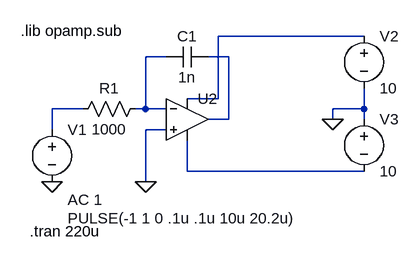
[diagram p0: schematic idealintegrator.asc]
idealintegrator.asc, the LTspice schematic file:
Version 4
SHEET 1 880 680
WIRE 576 32 352 32
WIRE 272 64 240 64
WIRE 368 64 336 64
WIRE 352 128 352 32
WIRE 352 128 304 128
WIRE 144 144 96 144
WIRE 240 144 240 64
WIRE 240 144 224 144
WIRE 272 144 240 144
WIRE 576 144 576 112
WIRE 576 144 528 144
WIRE 368 160 368 64
WIRE 368 160 336 160
WIRE 528 160 528 144
WIRE 576 160 576 144
WIRE 96 176 96 144
WIRE 272 176 240 176
WIRE 304 240 304 192
WIRE 576 240 304 240
WIRE 240 256 240 176
FLAG 240 256 0
FLAG 96 256 0
FLAG 528 160 0
SYMBOL res 240 128 R90
WINDOW 0 0 56 VBottom 2
WINDOW 3 32 56 VTop 2
SYMATTR InstName R1
SYMATTR Value 1000
SYMBOL cap 336 48 R90
WINDOW 0 0 32 VBottom 2
WINDOW 3 32 32 VTop 2
SYMATTR InstName C1
SYMATTR Value 1n
SYMBOL voltage 96 160 R0
WINDOW 3 24 152 Left 2
WINDOW 123 24 124 Left 2
WINDOW 39 0 0 Left 0
SYMATTR InstName V1
SYMATTR Value PULSE(-1 1 0 .1u .1u 10u 20.2u)
SYMATTR Value2 AC 1
SYMBOL Opamps\\UniversalOpamp2 304 160 R0
SYMATTR InstName U2
SYMBOL voltage 576 16 R0
WINDOW 123 0 0 Left 0
WINDOW 39 0 0 Left 0
SYMATTR InstName V2
SYMATTR Value 10
SYMBOL voltage 576 144 R0
WINDOW 123 0 0 Left 0
WINDOW 39 0 0 Left 0
SYMATTR InstName V3
SYMATTR Value 10
TEXT 62 332 Left 2 !.tran 220u
TEXT 48 24 Left 2 !.lib opamp.sub

The netlist it stands for:
* idealintegrator.asc
R1 N002 N004 1000
C1 N003 N002 1n
V1 N004 0 PULSE(-1 1 0 .1u .1u 10u 20.2u) AC 1
XU2 0 N002 N001 N005 N003 level.2 Avol=1Meg GBW=10Meg Slew=10Meg ilimit=25m rail=0 Vos=0 phimargin=45 en=0 enk=0 in=0 ink=0 Rin=500Meg  ; pins IN+ IN- V+ V- OUT
V2 N001 0 10
V3 0 N005 10
.tran 220u
.lib opamp.sub
.lib UniversalOpamps2.sub
.backanno
.end